# Altium project BoatHardware.PrjPcb
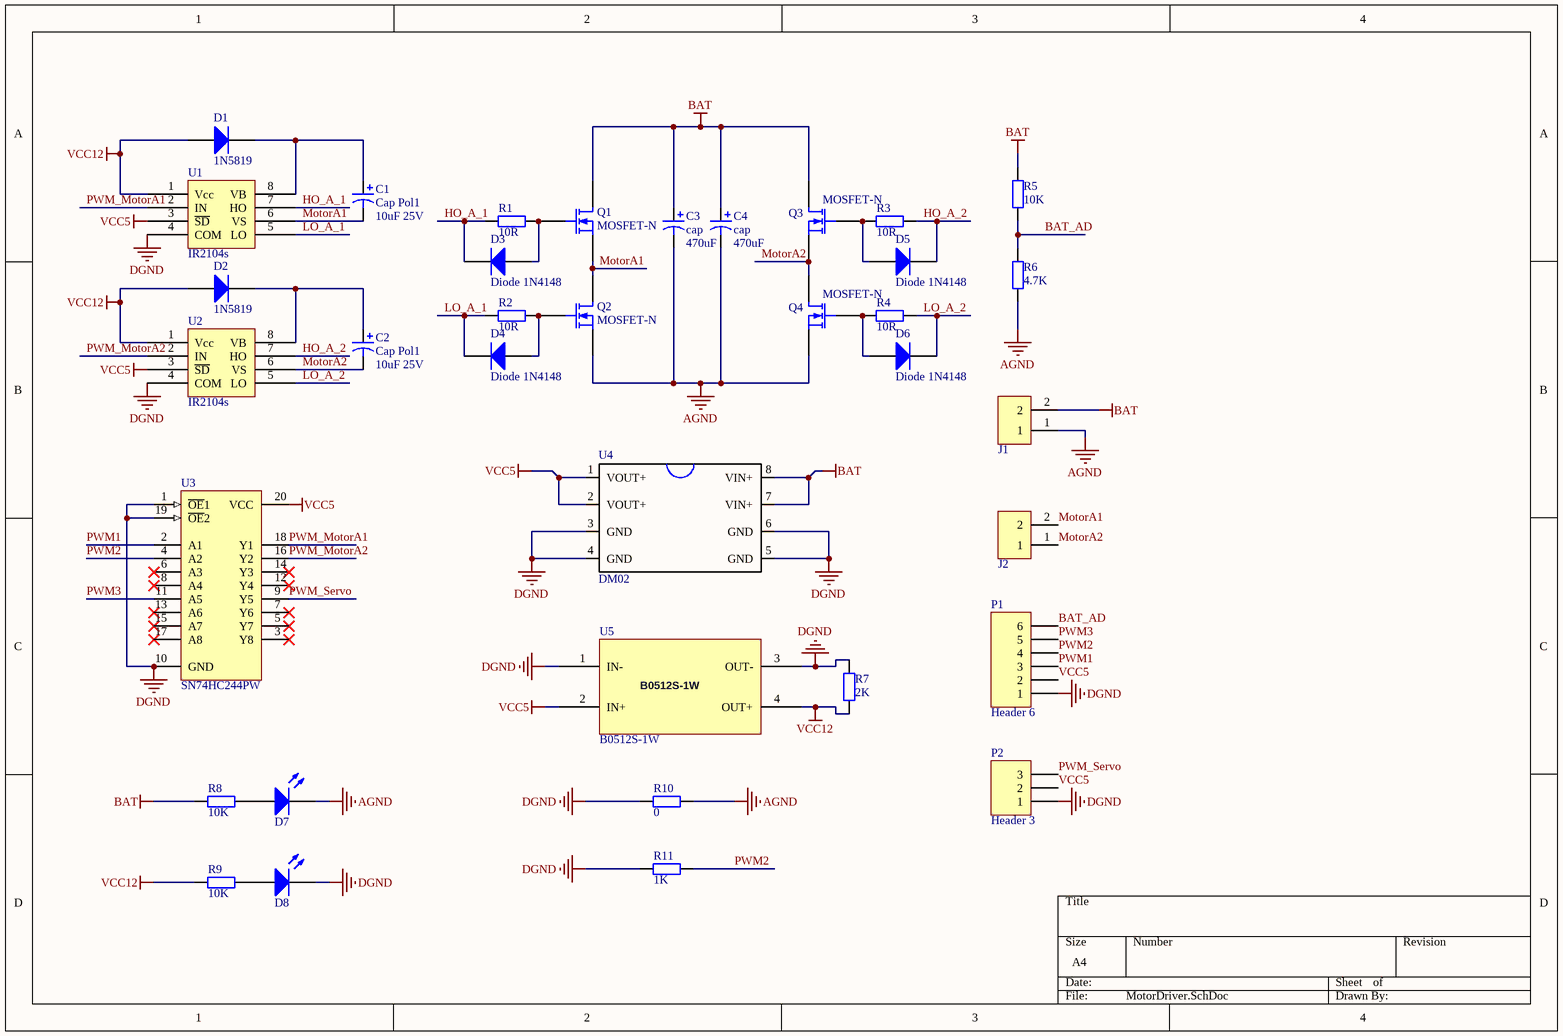
[diagram p0: MotorDriver.SchDoc]
1 sheet, 36 parts. Net scope: global (net labels, ports and power ports of the same name join across sheets).
Board file: MotorDriver.PcbDoc

## Sheet MotorDriver.SchDoc
size A4

### Parts
C1  Cap Pol1  value 10uF 25V  [Cap 3528B]
C2  Cap Pol1  value 10uF 25V  [Cap 3528B]
C3  cap  value 470uF  [cap贴片铝电解质470uF 16V]
C4  cap  value 470uF  [cap贴片铝电解质470uF 16V]
D1  1N5819  [DIO-214]
D2  1N5819  [DIO-214]
D3  Diode 1N4148  [0805]
D4  Diode 1N4148  [0805]
D5  Diode 1N4148  [0805]
D6  Diode 1N4148  [0805]
D7  12V  [LED_0805]  (value not drawn)
D8  12V  [LED_0805]  (value not drawn)
J1  接线端子2P  [接线端子KF301-2P]  (value not drawn)
J2  接线端子2P  [接线端子KF301-2P]  (value not drawn)
P1  Header 6  [HDR1X6]
P2  Header 3  [HDR1X3]
Q1  MOSFET-N  [TO-252]
Q2  MOSFET-N  [TO-252]
Q3  MOSFET-N  [TO-252]
Q4  MOSFET-N  [TO-252]
R1  value 10R  [0805]  (hidden comment: Res_)
R2  value 10R  [0805]  (hidden comment: Res_)
R3  value 10R  [0805]  (hidden comment: Res_)
R4  value 10R  [0805]  (hidden comment: Res_)
R5  value 10K  [0805]  (hidden comment: Res_)
R6  value 4.7K  [0805]  (hidden comment: Res_)
R7  value 2K  [0805]  (hidden comment: Res_)
R8  value 10K  [0805]  (hidden comment: Res_)
R9  value 10K  [0805]  (hidden comment: Res_)
R10  value 0  [1206]  (hidden comment: Res_)
R11  value 1K  [0805]  (hidden comment: Res_)
U1  IR2104s  [IR2104-SOIC8]
U2  IR2104s  [IR2104-SOIC8]
U3  SN74HC244PW  [74HC244-TSOP]
U4  DM02  [DM02]
U5  B0512S-1W  [B0512S-1W]

### Nets
AGND: C3.2 C4.2 D7.2(K) J1.1 Q2.3(S) Q4.3(S) R6.1 R10.2
BAT: C3.1 C4.1 J1.2 Q1.1(D) Q3.1(D) R5.2 R8.1 U4.7(VIN+) U4.8(VIN+)
DGND: D8.2(K) P1.1 P2.1 R7.1 R10.1 R11.1 U1.4(COM) U2.4(COM) U3.1(~{OE}1) U3.10(GND) U3.19(~{OE}2) U4.3(GND) U4.4(GND) U4.5(GND) U4.6(GND) U5.1(IN-) U5.3(OUT-)
VCC5: P1.2 P2.2 U1.3(~{SD}) U2.3(~{SD}) U3.20(VCC) U4.1(VOUT+) U4.2(VOUT+) U5.2(IN+)
VCC12: D1.1(A) D2.1(A) R7.2 R9.1 U1.1(Vcc) U2.1(Vcc) U5.4(OUT+)
BAT_AD: P1.6 R5.1 R6.2
HO_A_1: D3.2(K) R1.1 U1.7(HO)
HO_A_2: D5.2(K) R3.2 U2.7(HO)
LO_A_1: D4.2(K) R2.1 U1.5(LO)
LO_A_2: D6.2(K) R4.2 U2.5(LO)
MotorA1: C1.2 J2.2 Q1.3(S) Q2.1(D) U1.6(VS)
MotorA2: C2.2 J2.1 Q3.3(S) Q4.1(D) U2.6(VS)
PWM1: P1.3 U3.2(A1)
PWM2: P1.4 R11.2 U3.4(A2)
PWM3: P1.5 U3.11(A5)
PWM_MotorA1: U1.2(IN) U3.18(Y1)
PWM_MotorA2: U2.2(IN) U3.16(Y2)
PWM_Servo: P2.3 U3.9(Y5)
NetC1_1: C1.1 D1.2(K) U1.8(VB)
NetC2_1: C2.1 D2.2(K) U2.8(VB)
NetD3_1: D3.1(A) Q1.2(G) R1.2
NetD4_1: D4.1(A) Q2.2(G) R2.2
NetD5_1: D5.1(A) Q3.2(G) R3.1
NetD6_1: D6.1(A) Q4.2(G) R4.1
NetD7_1: D7.1(A) R8.2
NetD8_1: D8.1(A) R9.2

Not connected (* = marked no-connect by the designer): U3 3(Y8)* 5(Y7)* 6(A3)* 7(Y6)* 8(A4)* 12(Y4)* 13(A6)* 14(Y3)* 15(A7)* 17(A8)*

### Library data of the parts
C1 C2 = Cap Pol1: Polarized Capacitor (Radial); Published: 8-Jun-2000; LatestRevisionDate: 17-Jul-2002; LatestRevisionNote: Re-released for DXP Platform.; PackageReference: RB7.6-15; Publisher: Altium Limited
D1 D2 = 1N4007
D3-D6 = Diode 1N4148: High Conductance Fast Diode; Published: 8-Jun-2000; LatestRevisionDate: 17-Jul-2002; LatestRevisionNote: Re-released for DXP Platform.; DatasheetVersion: 1997; PackageReference: DO-35; Publisher: Altium Limited; PackageDescription: Diode, Axial; Body 3.8 x 1.9 mm (LxDia. max), Lead Dia. 0.53 mm (max); Code_JEDEC: DO-204-AH; ComponentLink1Description: Manufacturer Link; ComponentLink1URL: http://www.fairchildsemi.com/; ComponentLink2Description: Datasheet; ComponentLink2URL: http://www.fairchildsemi.com/ds/1N%2F1N4148.pdf
D7 D8 = LED_
P1 = Header 6: Header, 6-Pin; LatestRevisionDate: 17-Jul-2002; LatestRevisionNote: Re-released for DXP Platform.; Publisher: Altium Limited
P2 = Header 3: Header, 3-Pin; LatestRevisionDate: 17-Jul-2002; LatestRevisionNote: Re-released for DXP Platform.; Publisher: Altium Limited
Q1-Q4 = MOSFET-N: N-Channel MOSFET; Published: 8-Jun-2000; LatestRevisionDate: 17-Jul-2002; LatestRevisionNote: Re-released for DXP Platform.; PackageVersion: 1995/1996; PackageReference: E3; Publisher: Altium Limited
U1 U2 = 2014s
U3 = SN74LVC244APW: Octal Buffer/Driver with 3-State Outputs; Published: 8-Jun-2000; LatestRevisionDate: 16-Oct-2006; LatestRevisionNote: IPC-7351 Footprint Added.; DatasheetVersion: Apr-1999; PackageVersion: Feb-1999; PackageReference: PW020; Publisher: Altium Limited; PackageDescription: 20-Pin Thin Small Outline Package 0.65 mm Pitch; ComponentLink1Description: Manufacturer Link; ComponentLink1URL: http://www.ti.com/; ComponentLink2Description: Datasheet; ComponentLink2URL: http://www-s.ti.com/sc/ds/sn74lvc244a.pdf
U4 = DM02: DC-DC 5V